# EAGLE schematic adxl345 (EAGLE 7.5.0)
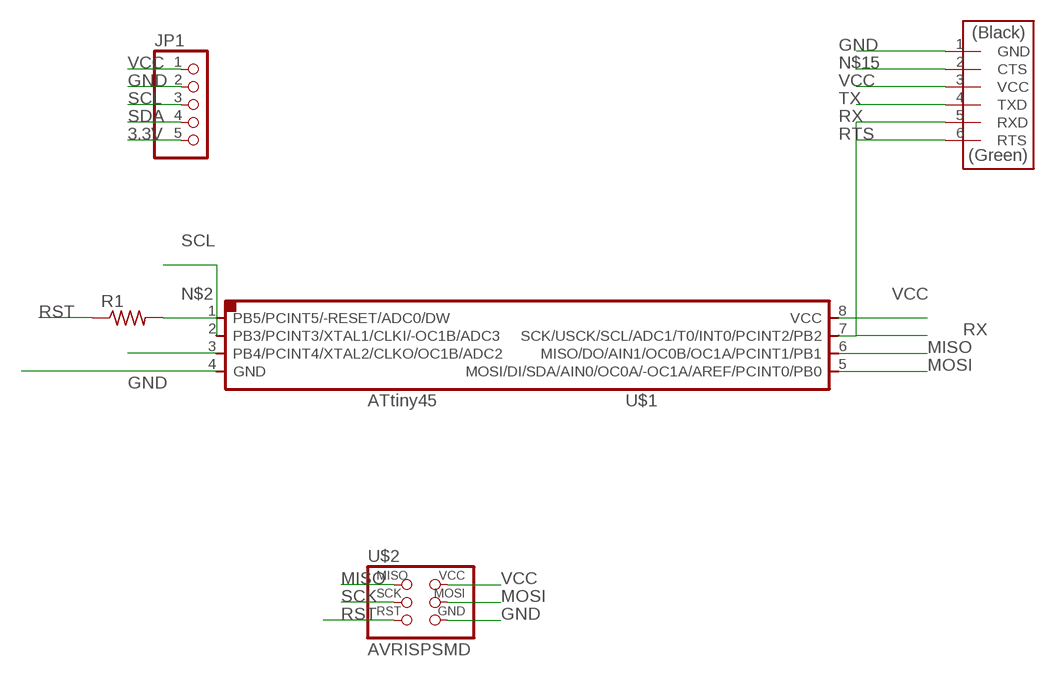
[diagram p0: schematic, sheet 1]

## Parts
JP1  PINHD-1X5/90  [1X05/90]
R1  RES-US1206  [R1206]
U$1  ATTINY45SI  [SOIC8]
U$2  AVRISPSMD  [2X03SMD]
U$3  FTDI-SMD-HEADER  [1X06SMD]

## Nets
3.3V: JP1.5
GND: JP1.2 U$1.4(GND) U$2.6(GND) U$3.1(GND)
MISO: U$1.6(MISO/DO/AIN1/OC0B/OC1A/PCINT1/PB1) U$2.1(MISO)
MOSI: U$1.5(MOSI/DI/SDA/AIN0/OC0A/-OC1A/AREF/PCINT0/PB0) U$2.4(MOSI)
N$2: R1.2 U$1.2(PB3/PCINT3/XTAL1/CLKI/-OC1B/ADC3)
N$15: U$3.2(CTS)
RST: R1.1 U$2.5(RST)
RTS: U$3.6(RTS)
RX: U$1.7(SCK/USCK/SCL/ADC1/T0/INT0/PCINT2/PB2) U$3.5(RXD)
SCK: U$2.3(SCK)
SCL: JP1.3 U$1.1(PB5/PCINT5/-RESET/ADC0/DW)
SDA: JP1.4 U$1.3(PB4/PCINT4/XTAL2/CLKO/OC1B/ADC2)
TX: U$3.4(TXD)
VCC: JP1.1 U$1.8(VCC) U$2.2(VCC) U$3.3(VCC)

## Library data of the parts
JP1 = pinhead:PINHD-1X5: PIN HEADER
R1 = fab:RES-US: Resistor (US Symbol) Variants with postfix FAB are widened to allow the routing of internal traces
U$1 = fab:ATTINY45
U$2 = fab:AVRISP
U$3 = fab:FTDI-SMD-HEADER